# EAGLE design TelemetryBridge (EAGLE 6.4)
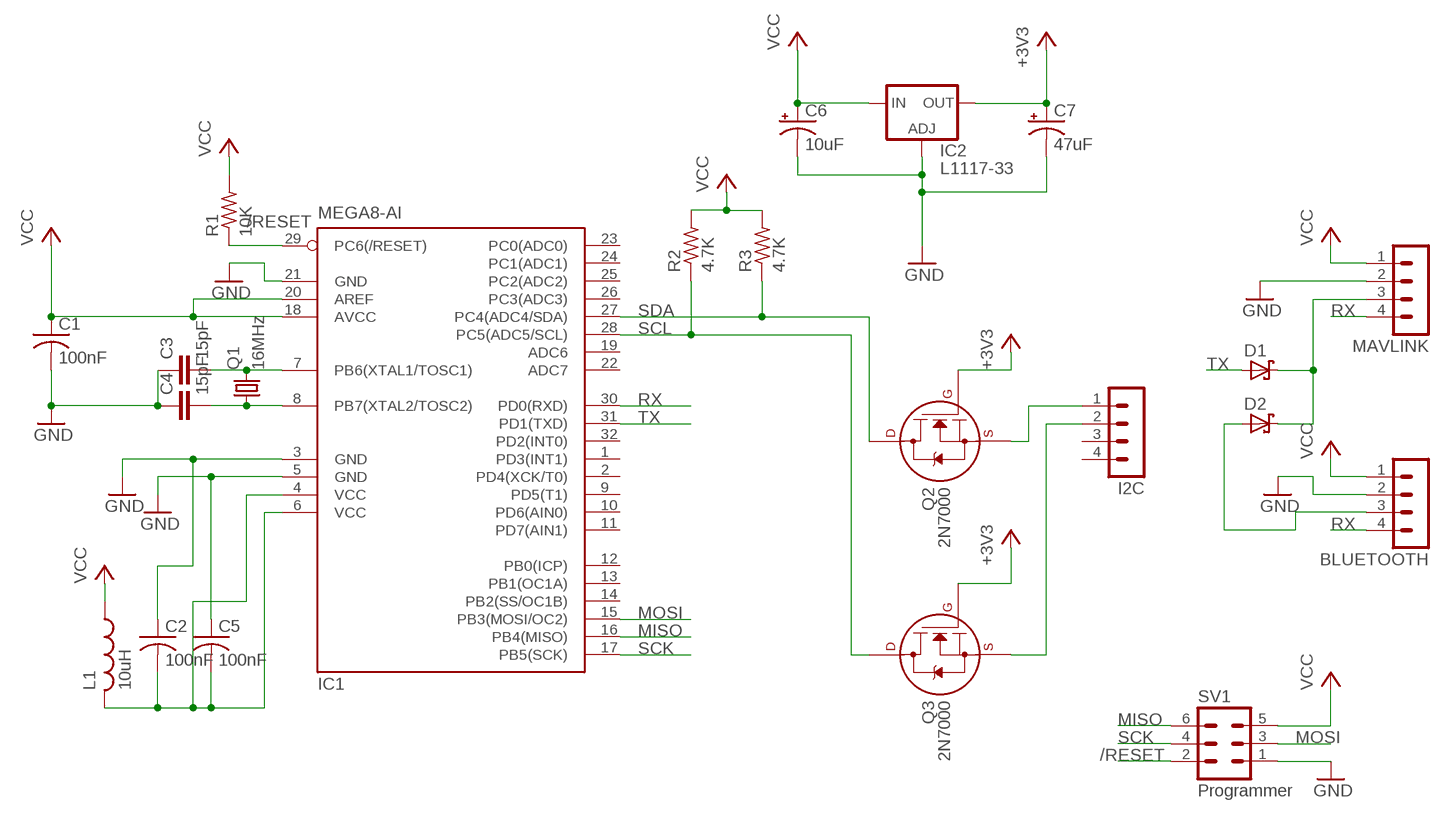
[diagram p0: schematic, sheet 1]

## Parts
BLUETOOTH  MA04-1  [MA04-1]
C1  100nF  C-USC0805  [C0805]
C2  100nF  C-USC0805  [C0805]
C3  15pF  C-EUC0805  [C0805]
C4  15pF  C-EUC0805  [C0805]
C5  100nF  C-USC0805  [C0805]
C6  10uF  CPOL-USC  [PANASONIC_C]
C7  47uF  CPOL-USD  [PANASONIC_D]
D1  SCHOTTKY-DIODE  [DO-214AC]
D2  SCHOTTKY-DIODE  [DO-214AC]
I2C  MA04-1  [MA04-1]
IC1  MEGA8-AI  [TQFP32-08]
IC2  L1117-33  LD117ADT-TR  [DPACK]
L1  10uH  INDUCTOR  [0805]
MAVLINK  MA04-1  [MA04-1]
Q1  16MHz  CSM-7X-DU  [CSM-7X-DU]
Q2  2N7000  2N7002A_SOT23  [SOT-23]
Q3  2N7000  2N7002A_SOT23  [SOT-23]
R1  10K  R-US_R0805  [R0805]
R2  4.7K  R-US_R0805  [R0805]
R3  4.7K  R-US_R0805  [R0805]
SV1  Programmer  KEVINSLIB_MA03-2  [KEVINSLIB_MA03-2]

## Nets
+3V3: C7.+ IC2.4(OUT) Q2.1(G) Q3.1(G)
/RESET: IC1.29(PC6(/RESET)) R1.1 SV1.2
GND: BLUETOOTH.2 C1.2 C2.1 C3.1 C4.1 C5.1 C6.- C7.- IC1.3(GND) IC1.5(GND) IC1.21(GND) IC2.1(ADJ) MAVLINK.2 SV1.1
MISO: IC1.16(PB4(MISO)) SV1.6
MOSI: IC1.15(PB3(MOSI/OC2)) SV1.3
N$1: BLUETOOTH.3 D2.A
N$2: D1.C D2.C MAVLINK.3
N$3: C4.2 IC1.8(PB7(XTAL2/TOSC2)) Q1.1
N$4: C2.2 C5.2 IC1.4(VCC) IC1.6(VCC) L1.2
N$5: I2C.1 Q2.2(S)
N$6: C3.2 IC1.7(PB6(XTAL1/TOSC1)) Q1.2
N$7: I2C.2 Q3.2(S)
RX: BLUETOOTH.4 IC1.30(PD0(RXD)) MAVLINK.4
SCK: IC1.17(PB5(SCK)) SV1.4
SCL: IC1.28(PC5(ADC5/SCL)) Q3.3(D) R2.1
SDA: IC1.27(PC4(ADC4/SDA)) Q2.3(D) R3.1
TX: D1.A IC1.31(PD1(TXD))
VCC: BLUETOOTH.1 C1.1 C6.+ IC1.18(AVCC) IC1.20(AREF) IC2.3(IN) L1.1 MAVLINK.1 R1.2 R2.2 R3.2 SV1.5
Unconnected: I2C.3 I2C.4 IC1.1(PD3(INT1)) IC1.2(PD4(XCK/T0)) IC1.9(PD5(T1)) IC1.10(PD6(AIN0)) IC1.11(PD7(AIN1)) IC1.12(PB0(ICP)) IC1.13(PB1(OC1A)) IC1.14(PB2(SS/OC1B)) IC1.19(ADC6) IC1.22(ADC7) IC1.23(PC0(ADC0)) IC1.24(PC1(ADC1)) IC1.25(PC2(ADC2)) IC1.26(PC3(ADC3)) IC1.32(PD2(INT0))

## Library data of the parts
BLUETOOTH I2C MAVLINK = con-lstb:MA04-1: PIN HEADER; OC_FARNELL: unknown; OC_NEWARK: unknown
C1 C2 C5 = rcl:C-US: CAPACITOR, American symbol
C3 C4 = rcl:C-EU: CAPACITOR, European symbol
C6 C7 = rcl:CPOL-US: POLARIZED CAPACITOR, American symbol
D1 D2 = KevinsLib:SCHOTTKY-DIODE: Schottky Diode
IC1 = atmel:MEGA8: MICROCONTROLLER 8 Kbytes FLASH, 1 kbytes SRAM, 512 bytes EEPROM, USART, 6-channel 10 bit ADC, 2-channel 8 bit ADC Pin compatible with Atmega48, ATMega88, ATMega168 Source: avr.lbr; MPN: ATMEGA8-16AU; OC_FARNELL: 9171371; OC_NEWARK: 73M8863
IC2 = v-reg:LD117A?*: Low drop fixed and adjustable positive voltage regulators 1 A Source: http://www.st.com/stonline/products/literature/ds/7194/ld1117axx.pdf
L1 = KevinsLib:INDUCTOR
Q1 = crystal:CSM-7X-DU: SMD CRYSTAL Source: www.ecsxtal.com .. Crystal 3.6864MHz CSM_7X_DU.PDF; OC_FARNELL: unknown; OC_NEWARK: unknown
Q2 Q3 = transistors:2N700*: 2N7000, 2N7002, NDS7002A N-channel enhancement mode MOSFET
R1-R3 = rcl:R-US_: RESISTOR, American symbol
SV1 = KevinsLib:KEVINSLIB_MA03-2: PIN HEADER 3 x 2 Pin Header with Larger pads; OC_FARNELL: unknown; OC_NEWARK: unknown

## Net classes
0 default: width 0.406 mm, drill 0.762 mm, clearance 0.356 mm
1 TPFQ Pad: width 0.203 mm, clearance 0.203 mm

## Board
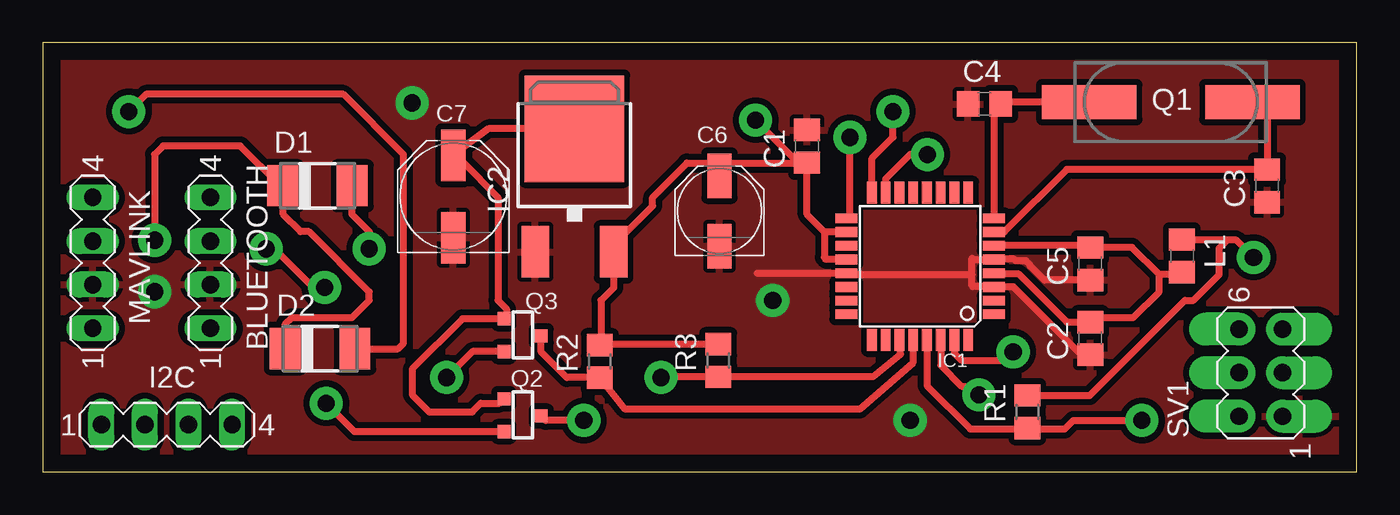
[diagram p1: board, top side]
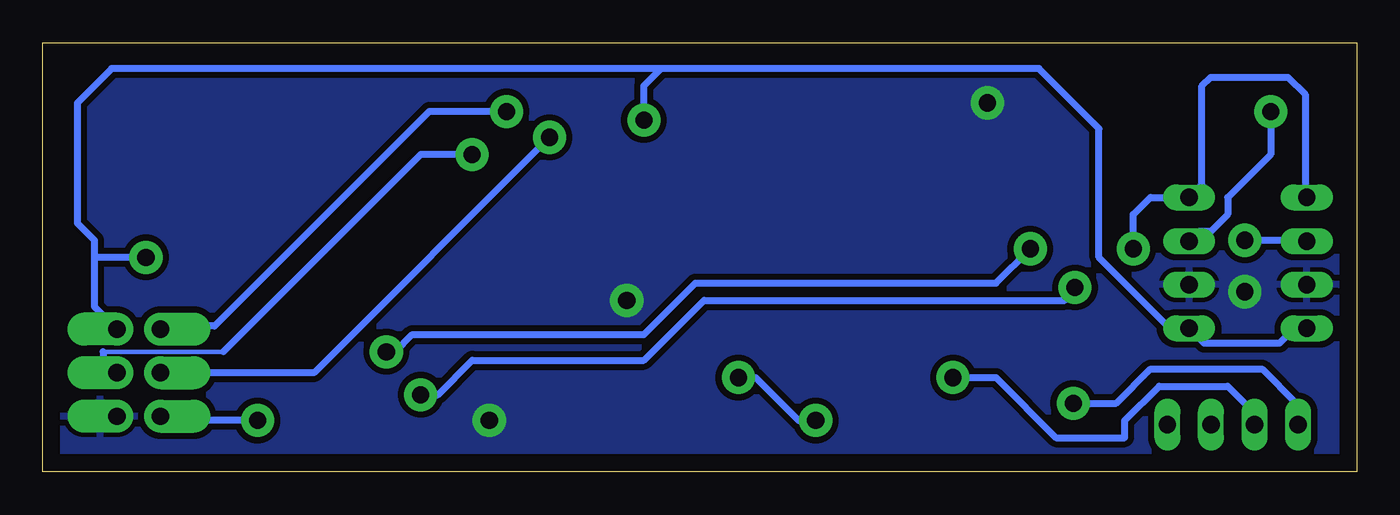
[diagram p2: board, bottom side, seen from below]

Size 76.5 x 25 mm. Coordinates in mm from the lower left corner, seen from the top.
Outline: 0,0 76.5,0 76.5,25 0,25 0,0
Copper layers (1*16): Top 0.035mm / dielectric 1.5mm / Bottom 0.035mm
Design rules "default *": minimum track width 10mil, minimum drill 24mil, track to track 8mil, track to pad 8mil, pad to pad 8mil, via to via 8mil, smd to smd 8mil, copper to edge 40mil, drill to drill 8mil, minimum pad ring 10mil, minimum via ring 8mil, stop-mask expansion 4mil, vias tented up to drill 0mil, thermal gap 10mil

### Footprints (pad centres in the part's own frame; a part is rotated, then mirrored left to right if it is on the bottom)
MA04-1 = drill 1.016 long: 1 -3.81,0; 2 -1.27,0; 3 1.27,0; 4 3.81,0
C0805 = smd 1.3 x 1.5: 1 -0.95,0; 2 0.95,0
PANASONIC_C = smd 2.6 x 1.4: + 2.05,0; - -2.05,0
PANASONIC_D = smd 3 x 1.4: + 2.4,0; - -2.4,0
DO-214AC = smd 1.8 x 2.4: A 2.025,0; C -2.025,0
TQFP32-08 = smd 1.27 x 0.559: 1 -4.293,2.8; 2 -4.293,2; 3 -4.293,1.2; 4 -4.293,0.4; 5 -4.293,-0.4; 6 -4.293,-1.2; 7 -4.293,-2; 8 -4.293,-2.8; 17 4.293,-2.8; 18 4.293,-2; 19 4.293,-1.2; 20 4.293,-0.4; 21 4.293,0.4; 22 4.293,1.2; 23 4.293,2; 24 4.293,2.8 | smd 0.559 x 1.27: 9 -2.8,-4.293; 10 -2,-4.293; 11 -1.2,-4.293; 12 -0.4,-4.293; 13 0.4,-4.293; 14 1.2,-4.293; 15 2,-4.293; 16 2.8,-4.293; 25 2.8,4.293; 26 2,4.293; 27 1.2,4.293; 28 0.4,4.293; 29 -0.4,4.293; 30 -1.2,4.293; 31 -2,4.293; 32 -2.8,4.293
DPACK = smd 1.6 x 3: 1 -2.28,-4.8; 3 2.28,-4.8 | smd 5.8 x 6.2: 4 0,2.38
0805 = smd 1.3 x 1.5: 1 -0.95,0; 2 0.95,0
CSM-7X-DU = smd 5.5 x 2: 1 -4.75,0; 2 4.75,0
SOT-23 = smd 0.762 x 0.762: 1 -0.979,-1.101; 2 0.94,-1.101; 3 0.025,1.067
R0805 = smd 1.3 x 1.5: 1 -0.95,0; 2 0.95,0
KEVINSLIB_MA03-2 = drill 1.016 pad 1.93 offset: 1 -2.54,-1.27; 2 -2.54,1.27; 3 0,-1.27; 4 0,1.27; 5 2.54,-1.27; 6 2.54,1.27

### Placement (x,y rotation side)
BLUETOOTH  9.75,12.18 90 top
C1  44.49,18.98 90 top
C2  60.99,7.78 90 top
C3  71.29,16.67 90 top
C4  54.83,21.44 0 top
C5  60.99,12.13 90 top
C6  39.4,15.21 90 top
C7  23.9,16.05 90 top
D1  15.99,16.68 0 top
D2  16.14,7.18 0 top
I2C  7.21,2.75 0 top
IC1  51.08,11.98 180 top
IC2  30.95,17.62 0 top
L1  66.33,12.59 270 top
MAVLINK  2.9,12.18 90 top
Q1  65.68,21.55 0 top
Q2  27.95,3.29 270 top
Q3  27.95,7.95 270 top
R1  57.33,3.51 90 top
R2  32.43,6.44 90 top
R3  39.33,6.49 90 top
SV1  70.92,5.78 90 top

### Tracks (layer width: path | path; a pad name or v marks a point on that pad's centre or on a via)
+3V3
  Top 0.406: Q2.1 26.58,4 25.5,4 25,3.5 22.5,3.5 21.5,4.5 21.5,6 24.43,8.93 Q3.1 27,9.08 27,9.5 26.5,10 26.5,16 24.4,18.1 C7.+ 25.95,20 IC2.4
/RESET  (via drill 1 pad 1.93)
  Top 0.406: v64,3 60,3 59.5,2.5 57.39,2.5 R1.1 57.27,2.5 54,2.5 51.48,5.02 IC1.29
  Bottom 0.406: v64,3 69.41,3 SV1.2
GND  (via drill 1 pad 1.93)
  Top 0.406: IC1.3 55.39,10.8 | 55.39,10.8 56.5,10.8 60.47,6.83 C2.1 | 55.39,10.8 54.15,10.8 54.1,10.85 54.1,11.5 | 54.1,11.5 54.1,12.45 54.17,12.38 IC1.5 55.39,12.4 56.55,12.4 56.65,12.3 57.25,12.3 57.5,12.05 57.5,12 58.32,11.18 C5.1 | 41.59,11.58 IC1.21 46.87,11.5 54.1,11.5
  other vias: 21.5,21.5 6.5,10.5 50.5,3 42.5,10
  pour Top: 0,25 76.5,25 76.5,0 0,0
  pour Bottom: 0,25 76.5,25 76.5,0 0,0
MISO  (via drill 1 pad 1.93)
  Top 0.406: 48.25,16.3 IC1.16 48.28,18.28 49.5,19.5 v49.5,21
  Bottom 0.406: v49.5,21 54,21 66.5,8.5 69.47,8.5 SV1.6
MOSI  (via drill 1 pad 1.93)
  Top 0.406: 49,16.35 IC1.15 49.08,17.08 50.5,18.5 v51.5,18.5
  Bottom 0.254: 66,7 73,7
  Bottom 0.406: v51.5,18.5 54.5,18.5 66,7 | 72,5.97 SV1.3 72.19,6 73,6 73,7
N$1  (via drill 1 pad 1.93)
  Top 0.406: D2.A 20.68,7.18 21,7.5 21,18.5 17.5,22 6,22 v5,21
  Bottom 0.406: v5,21 5,18.5 7.5,16 7.5,15 8.5,14 9.2,14 BLUETOOTH.3
N$2  (via drill 1 pad 1.93)
  Top 0.406: D2.C 14.12,8.62 14.5,9 18,9 19,10 19,10.5 15.5,14 15,14 14,15 14,16.64 D1.C 13.82,16.68 11.5,19 7,19 6.5,18.5 v6.5,13.5
  Bottom 0.406: v6.5,13.5 2.95,13.5 MAVLINK.3
N$3
  Top 0.406: Q1.1 55.78,21.55 C4.2 55.37,21.44 IC1.8
N$4
  Top 0.406: L1.2 66.19,11.5 65,11.5 | 65,11.5 63.42,13.08 C5.2 60.89,13.18 IC1.6 | 65,11.5 65,10.5 63.5,9 61.26,9 C2.2 59.62,8.73 56.8,11.55 55.4,11.55 IC1.4
N$5  (via drill 1 pad 1.93)
  Top 0.406: Q2.2 18.15,2.35 v16.5,4
  Bottom 0.406: v16.5,4 14,4 12,6 5.5,6 3.5,4 3.5,2.85 I2C.1
N$6
  Top 0.406: Q1.2 71.29,21.55 C3.2 59.62,17.62 56,14 55.39,14 IC1.7
N$7  (via drill 1 pad 1.93)
  Top 0.406: Q3.2 25.01,7.01 v23.5,5.5
  Bottom 0.406: v23.5,5.5 21,5.5 17.5,2 13.5,2 13.5,3 11.5,5 7.5,5 6,3.5 6,2.81 I2C.2
RX  (via drill 1 pad 1.93)
  Top 0.406: IC1.30 52.28,6.22 53.5,5 54,5 v54.5,4.5 | v16.4,10.75 15.75,10.75 13.5,13 v13,13
  Bottom 0.406: MAVLINK.4 3,16.09 3,22 4,23 8.5,23 9,22.5 9,16.74 BLUETOOTH.4 12,16 13,15 v13,13 | v54.5,4.5 53.5,4.5 51.5,6.5 41.5,6.5 38,10 17,10 v16.4,10.75
SCK  (via drill 1 pad 1.93)
  Top 0.406: IC1.17 47,14.99 v47,19.5
  Bottom 0.406: v47,19.5 60.72,5.78 SV1.4
SCL
  Top 0.406: IC1.28 50.65,6.35 47.55,3.65 33.9,3.65 R2.1 30.5,5.5 29.02,6.98 Q3.3
SDA  (via drill 1 pad 1.93)
  Top 0.406: IC1.27 49.95,6.85 48.35,5.55 R3.1 36.04,5.54 v36,5.5 | v31.5,3 29.28,3 Q2.3
  Bottom 0.406: v36,5.5 35,5.5 32.5,3 v31.5,3
TX  (via drill 1 pad 1.93)
  Top 0.406: IC1.31 53.08,6.92 53.5,6.5 56,6.5 v56.5,7 | v19,13 19,14 18,15 18,16.66 D1.A
  Bottom 0.406: v56.5,7 56,7 55,8 41.5,8 38.5,11 21,11 v19,13
VCC  (via drill 1 pad 1.93)
  Top 0.406: IC2.3 33.23,10.73 32.5,10 32.5,7.46 R2.2 32.48,7.44 R3.2 | L1.1 69,13.54 | 69,13.54 69.46,13.54 v70.5,12.5 | R1.2 60.96,4.46 66.5,10 67,10 68.5,11.5 68.5,13.04 69,13.54 | 43.97,18.03 C1.1 44.5,15 45.52,13.98 | 43.97,18.03 v41.5,20.5 | C6.+ 39.4,18 | IC2.3 33.23,12.27 | IC1.18 45.52,13.98 | IC1.20 45.62,12.38 45.52,12.48 | 45.52,12.48 45.5,12.5 | 45.52,13.98 45.52,12.48 | IC2.3 33.23,13.23 35.5,15.5 35.5,16 37.5,18 39.4,18 | 39.4,18 43.94,18 43.97,18.03
  Bottom 0.406: 72.5,8.63 SV1.5 73.5,9.63 73.5,12.5 | MAVLINK.1 3.63,8.37 4.5,7.5 8.88,7.5 BLUETOOTH.1 10.87,8.37 15,12.5 15,20 18.5,23.5 40.5,23.5 | 73.5,12.5 73.5,13.5 74.5,14.5 74.5,21.5 72.5,23.5 40.5,23.5 | v70.5,12.5 73.5,12.5 | v41.5,20.5 41.5,22.5 40.5,23.5